# EAGLE schematic 640 motherboard (EAGLE 6.1)
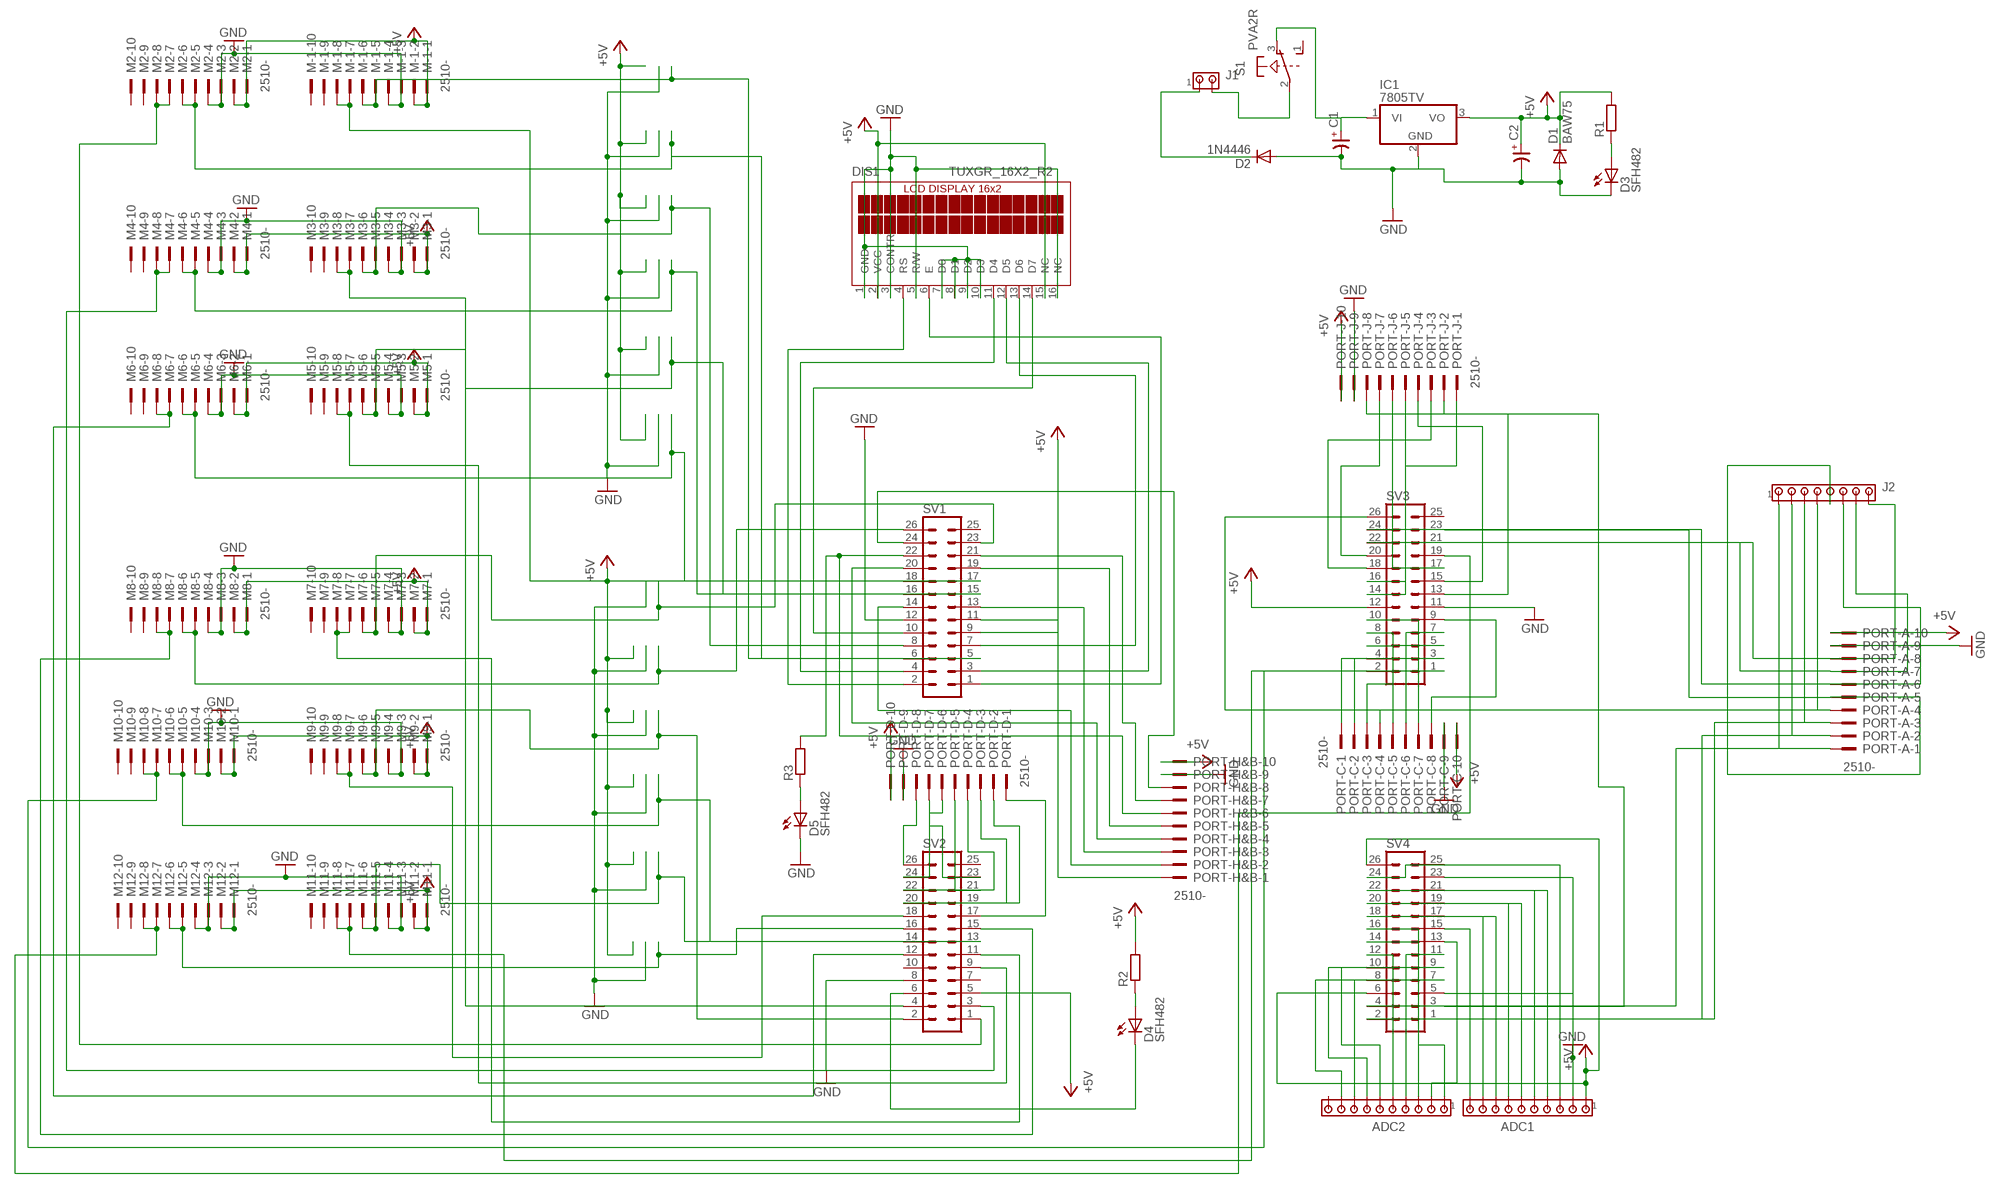
[diagram p0: schematic, sheet 1]

## Parts
ADC1  MTA10-100  [10X10MTA]
ADC2  MTA10-100  [10X10MTA]
C1  CP-E-050X125  [E-050X125]
C2  CP-E-050X125  [E-050X125]
D1  BAW75  [DO35-10]
D2  1N4446  [DO35-10]
D3  SFH482  [SFH482]
D4  SFH482  [SFH482]
D5  SFH482  [SFH482]
DIS1  TUXGR_16X2_R2  [TUXGR_16X2_R2]
IC1  7805TV  [TO220V]
J1  MTA02-156  [1X2MTA]
J2  MTA08-100  [10X08MTA]
M2  2510-  [PAK100/2500-10]
M3  2510-  [PAK100/2500-10]
M4  2510-  [PAK100/2500-10]
M5  2510-  [PAK100/2500-10]
M6  2510-  [PAK100/2500-10]
M7  2510-  [PAK100/2500-10]
M8  2510-  [PAK100/2500-10]
M9  2510-  [PAK100/2500-10]
M10  2510-  [PAK100/2500-10]
M11  2510-  [PAK100/2500-10]
M12  2510-  [PAK100/2500-10]
M-1  2510-  [PAK100/2500-10]
PORT-A  2510-  [PAK100/2500-10]
PORT-C  2510-  [PAK100/2500-10]
PORT-D  2510-  [PAK100/2500-10]
PORT-H&B  2510-  [PAK100/2500-10]
PORT-J  2510-  [PAK100/2500-10]
R1  R-EU_0207/10  [0207/10]
R2  R-EU_0207/10  [0207/10]
R3  R-EU_0207/10  [0207/10]
S1  PVA2R  [PVA2R]
SV1  ML26  [ML26]
SV2  ML26  [ML26]
SV3  ML26  [ML26]
SV4  ML26  [ML26]

## Nets
+5V: ADC1.1 C2.+ D1.C DIS1.2(VCC) DIS1.15(NC) IC1.3(VO) M2.1 M2.2 M3.1 M3.2 M4.1 M4.2 M5.1 M5.2 M6.1 M6.2 M7.1 M7.2 M8.1 M8.2 M9.1 M9.2 M10.1 M10.2 M11.1 M11.2 M12.1 M12.2 M-1.1 M-1.2 PORT-A.10 PORT-C.10 PORT-D.10 PORT-H&B.10 PORT-J.10 R1.2 R2.2 SV1.9 SV2.5 SV3.12 SV4.6 SV4.26
GND: ADC1.2 C1.- C2.- D1.A D2.A D3.K(C) D5.K(C) DIS1.1(GND) DIS1.3(CONTR) DIS1.5(R/W) DIS1.7(D0) DIS1.8(D1) DIS1.9(D2) DIS1.10(D3) DIS1.16(NC) IC1.2(GND) M2.3 M2.4 M3.3 M3.4 M4.3 M4.4 M5.3 M5.4 M6.3 M6.4 M7.3 M7.4 M8.3 M8.4 M9.3 M9.4 M10.3 M10.4 M11.3 M11.4 M12.3 M12.4 M-1.3 M-1.4 PORT-A.9 PORT-C.9 PORT-D.9 PORT-H&B.9 PORT-J.9 SV1.12 SV2.8 SV3.11 SV4.5 SV4.23
N$1: C1.+ IC1.1(VI) S1.3(1:O)
N$2: D2.C J1.1
N$3: PORT-C.1 SV3.4
N$4: M2.5 M2.6 SV1.5
N$5: M3.5 M3.6 SV1.8
N$6: M4.5 M4.6 SV1.16
N$7: M5.5 M5.6 SV1.15
N$8: M6.5 M6.6 SV1.18
N$9: M12.5 M12.6 SV2.16
N$10: PORT-C.2 SV3.3
N$11: M10.5 M10.6 SV2.14
N$12: M9.5 M9.6 SV2.2
N$13: M8.5 M8.6 SV1.26
N$14: M7.5 M7.6 SV1.23
N$15: ADC1.4 SV4.21
N$16: ADC1.5 SV4.22
N$17: ADC1.3 SV4.24
N$18: ADC1.6 SV4.19
N$19: ADC1.7 SV4.20
N$20: ADC1.8 SV4.17
N$21: ADC1.9 SV4.18
N$22: ADC1.10 SV4.15
N$23: ADC2.1 SV4.16
N$24: ADC2.2 SV4.13
N$25: ADC2.3 SV4.14
N$26: ADC2.4 SV4.11
N$27: ADC2.5 SV4.12
N$28: ADC2.7 SV4.10
N$29: ADC2.6 SV4.9
N$30: ADC2.9 SV4.8
N$31: M-1.5 M-1.6 SV1.6
N$32: M11.5 M11.6 SV2.13
N$33: PORT-C.3 SV3.6
N$34: PORT-C.4 SV3.5
N$35: PORT-C.5 SV3.8
N$36: PORT-C.6 SV3.7
N$37: PORT-C.7 SV3.10
N$38: PORT-C.8 SV3.9
N$39: PORT-J.1 SV3.14
N$40: PORT-J.2 SV3.13
N$41: PORT-J.3 SV3.16
N$42: PORT-J.4 SV3.15
N$43: PORT-J.5 SV3.18
N$44: PORT-J.6 SV3.17
N$45: PORT-J.7 SV3.20
N$46: PORT-J.8 SV4.3
N$47: ADC2.8 SV4.7
N$48: J2.1 PORT-A.1 SV4.4
N$49: J2.2 PORT-A.2 SV4.1
N$50: J2.3 PORT-A.3 SV4.2
N$51: J2.4 PORT-A.4 SV3.26
N$53: J2.5 PORT-A.5 SV3.23
N$54: J2.7 PORT-A.7 SV3.21
N$55: J2.8 PORT-A.8 SV3.22
N$56: PORT-D.8 SV2.26
N$57: PORT-D.7 SV2.23
N$58: PORT-D.6 SV2.24
N$59: PORT-D.5 SV2.21
N$60: PORT-D.2 SV2.20
N$61: PORT-D.3 SV2.19
N$62: PORT-D.4 SV2.22
N$63: PORT-D.1 SV2.17
N$64: D3.A R1.1
N$65: J1.2 S1.2(1:P)
N$66: DIS1.11(D4) SV1.4
N$67: DIS1.12(D5) SV1.3
N$68: DIS1.13(D6) SV1.7
N$69: DIS1.14(D7) SV1.10
N$70: DIS1.4(RS) SV1.2
N$71: DIS1.6(E) SV1.1
N$72: PORT-H&B.1 SV1.11
N$73: M2.7 M2.8 SV2.1
N$74: PORT-H&B.2 SV1.14
N$75: PORT-H&B.3 SV1.13
N$76: PORT-H&B.4 SV1.20
N$77: M3.7 M3.8 SV2.4
N$78: PORT-H&B.5 SV1.19
N$79: M-1.7 M-1.8 SV1.17
N$80: M5.7 M5.8 SV2.9
N$81: M4.7 M4.8 SV2.3
N$82: PORT-H&B.6 R3.2 SV1.22
N$83: PORT-H&B.7 SV1.21
N$84: M7.7 M7.8 SV2.11
N$85: M6.7 M6.8 SV2.12
N$86: PORT-H&B.8 SV1.24
N$87: D4.A R2.1
N$88: M9.7 M9.8 SV2.18
N$89: M8.7 M8.8 SV2.15
N$90: M11.7 M11.8 SV3.1
N$91: D4.K(C) SV2.6
N$92: M10.7 M10.8 SV3.2
N$97: M12.7 M12.8 SV3.19
N$100: J2.6 PORT-A.6 SV3.24
N$104: D5.A R3.1
Unconnected: ADC2.10 M2.9 M2.10 M3.9 M3.10 M4.9 M4.10 M5.9 M5.10 M6.9 M6.10 M7.9 M7.10 M8.9 M8.10 M9.9 M9.10 M10.9 M10.10 M11.9 M11.10 M12.9 M12.10 M-1.9 M-1.10 S1.1(1:S) S1.4(2:S) S1.5(2:P) S1.6(2:O) SV1.25 SV2.7 SV2.10 SV2.25 SV3.25 SV4.25

## Library data of the parts
ADC1 ADC2 = con-amp:MTA10-100: AMP connector
C1 C2 = cap-master:CP-: POLARIZED CAP
D1 = diode:BAW75: DIODE silicon-epitaxial planar diode
D2 = diode:1N4446: DIODE high speed (Philips)
D3-D5 = led:SFH482: IR LED infrared emitting diode, Infineon
DIS1 = display-lcd:TUXGR_16X2_R2: Tuxgraphics LCD display 16x2 characters reflective, without background light Source: tuxgr_12x2_r2.pdf
IC1 = linear:78*: Positive VOLTAGE REGULATOR Source: http://cache.national.com/ds/LM/LM78L05.pdf http://www.fairchildsemi.com/ds/LM/LM7805.pdf
J1 = con-amp:MTA02-156: AMP connector
J2 = con-amp:MTA08-100: AMP connector
M2-M12 M-1 PORT-A PORT-C PORT-D PORT-H&B PORT-J = con-3m:2510-: 3M (TM) Pak 100 4-Wall Header Source: 3M
R1-R3 = resistor:R-EU_: RESISTOR, European symbol
S1 = switch-misc:PVA2R: ITT SWITCH
SV1-SV4 = con-harting-ml:ML26: HARTING